# EAGLE design USB-CB (EAGLE 6.1)
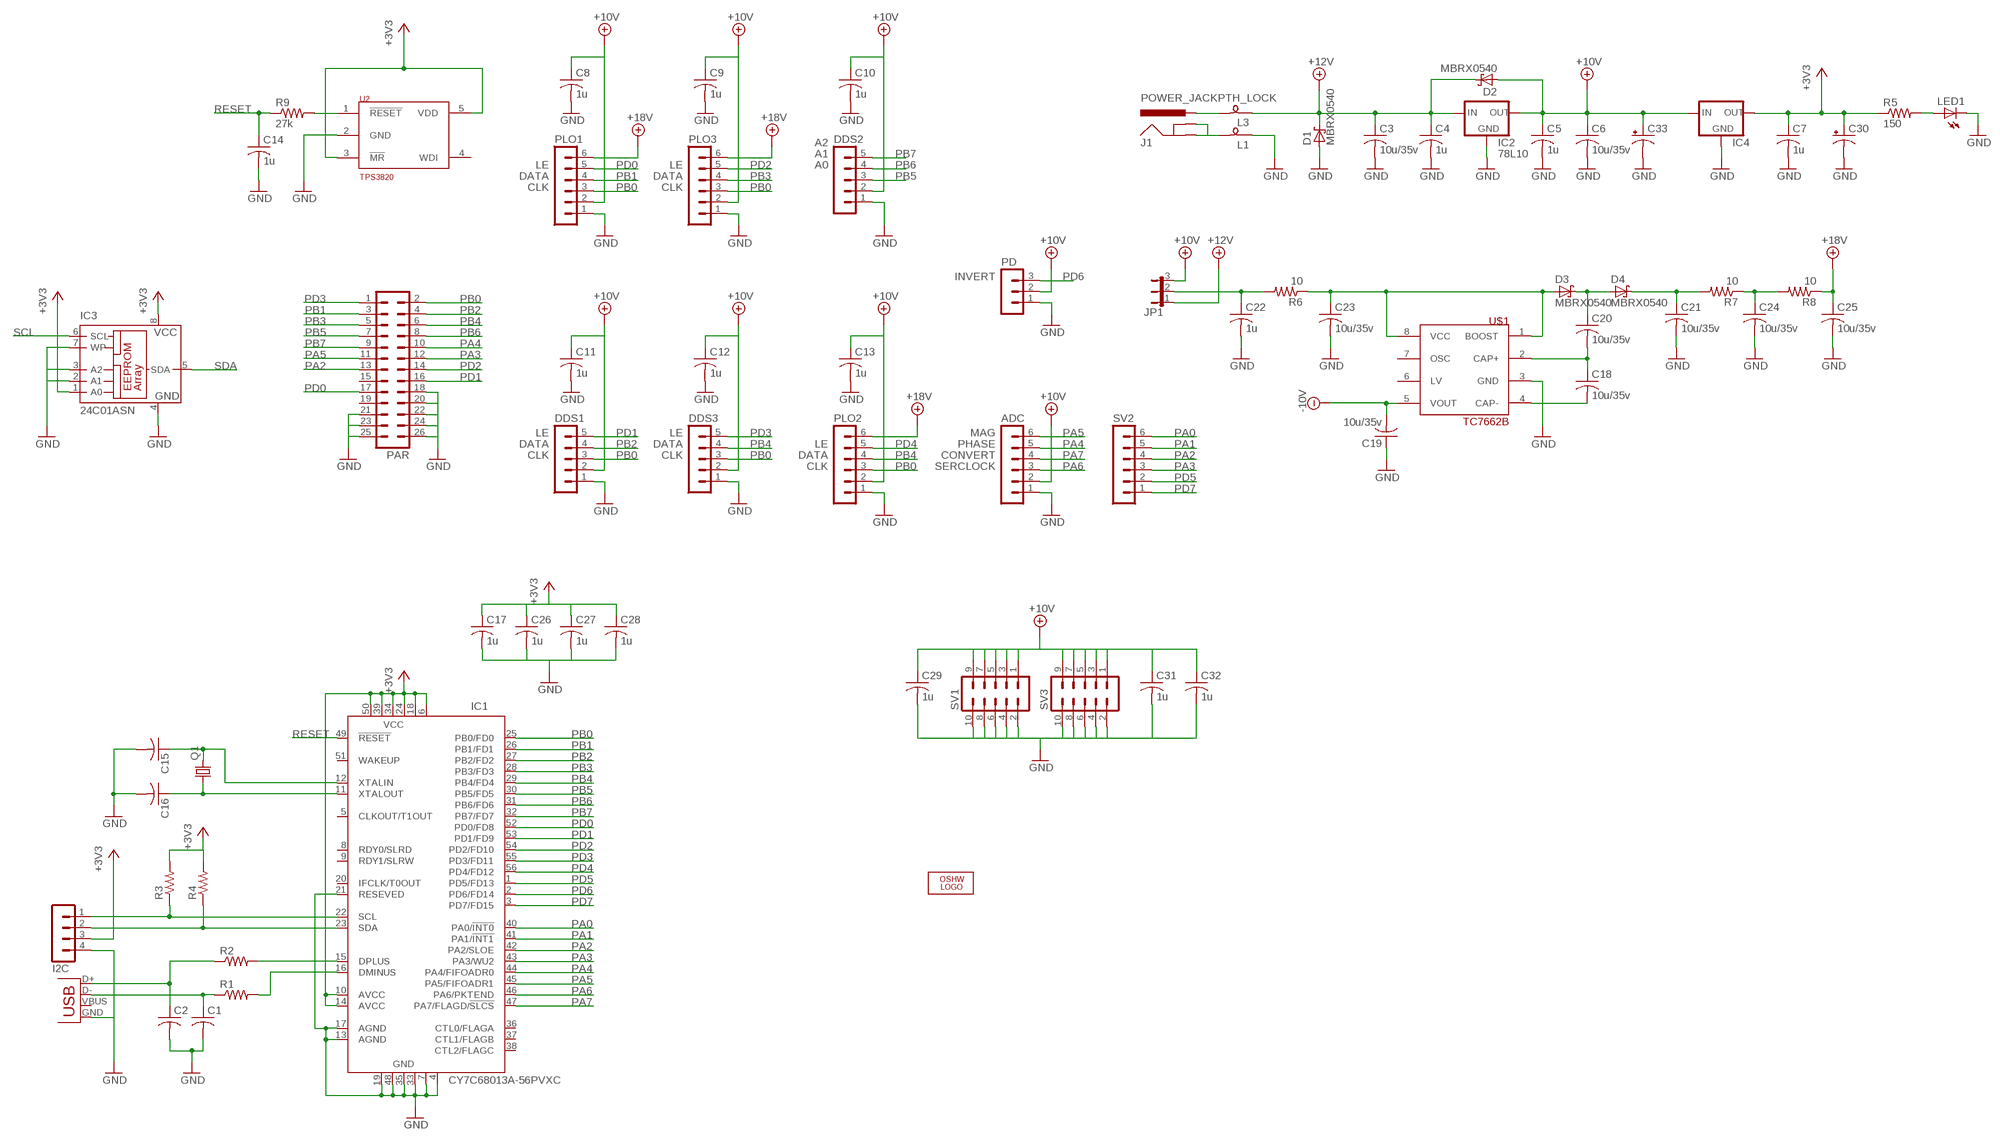
[diagram p0: schematic, sheet 1]

## Parts
ADC  MA06-1  [MA06-1]
C1  C-USC0603  [C0603]
C2  C-USC0603  [C0603]
C3  10u/35v  C-USC1206  [C1206]
C4  1u  C-USC0603  [C0603]
C5  1u  C-USC0603  [C0603]
C6  10u/35v  C-USC1206  [C1206]
C7  1u  C-USC0603  [C0603]
C8  1u  C-USC0603  [C0603]
C9  1u  C-USC0603  [C0603]
C10  1u  C-USC0603  [C0603]
C11  1u  C-USC0603  [C0603]
C12  1u  C-USC0603  [C0603]
C13  1u  C-USC0603  [C0603]
C14  1u  C-USC0603  [C0603]
C15  C-USC0603  [C0603]
C16  C-USC0603  [C0603]
C17  1u  C-USC0603  [C0603]
C18  10u/35v  C-USC1206  [C1206]
C19  10u/35v  C-USC1206  [C1206]
C20  10u/35v  C-USC1206  [C1206]
C21  10u/35v  C-USC1206  [C1206]
C22  1u  C-USC0603  [C0603]
C23  10u/35v  C-USC1206  [C1206]
C24  10u/35v  C-USC1206  [C1206]
C25  10u/35v  C-USC1206  [C1206]
C26  1u  C-USC0603  [C0603]
C27  1u  C-USC0603  [C0603]
C28  1u  C-USC0603  [C0603]
C29  1u  C-USC0603  [C0603]
C30  CPOL-USE2.5-6  [E2,5-6]
C31  1u  C-USC0603  [C0603]
C32  1u  C-USC0603  [C0603]
C33  CPOL-USE2.5-6  [E2,5-6]
D1  MBRX0540  [SOD323-R]
D2  MBRX0540  [SOD323-R]
D3  MBRX0540  [SOD323-R]
D4  MBRX0540  [SOD323-R]
DDS1  MA05-1  [MA05-1]
DDS2  MA05-1  [MA05-1]
DDS3  MA05-1  [MA05-1]
I2C  MA04-1  [MA04-1]
IC1  CY7C68013A-56PVXC  [SSOP56]
IC2  78L10  78XXS  [78XXS]
IC3  24C01ASN  [SO-08]
IC4  78LXXAC  [SOT89R]
J1  POWER_JACKPTH_LOCK  [POWER_JACK_PTH_LOCK]
JP1  JP2E  [JP2]
L1  SM-B5  [SM-B5]
L3  SM-B5  [SM-B5]
LED1  LED5MM  [LED5MM]
LOGO1  OSHW_LOGO_FILLX0200-NT  [OSHW_FILLX200_NOTEXT]
PAR  MA13-2  [MA13-2]
PD  MA03-1  [MA03-1]
PLO1  MA06-1  [MA06-1]
PLO2  MA06-1  [MA06-1]
PLO3  MA06-1  [MA06-1]
Q1  CRYSTALHC49S  [HC49/S]
R1  R-US_R0603  [R0603]
R2  R-US_R0603  [R0603]
R3  R-US_R0603  [R0603]
R4  R-US_R0603  [R0603]
R5  150  R-US_R0603  [R0603]
R6  10  R-US_R0603  [R0603]
R7  10  R-US_R0603  [R0603]
R8  10  R-US_R0603  [R0603]
R9  27k  R-US_R0603  [R0603]
SV1  MA05-2PIN  [MA05-2]
SV2  MA06-1  [MA06-1]
SV3  MA05-2PIN  [MA05-2]
U2  TPS3820  [SC74_INFINEON]
U$1  TC7662B  [SO-08]
X1  USBSMD  [USB-MINIB]

## Nets
+3V3: C7.1 C17.1 C26.1 C27.1 C28.1 C30.+ I2C.3 IC1.6(VCC) IC1.10(AVCC) IC1.14(AVCC) IC1.18(VCC) IC1.24(VCC) IC1.34(VCC) IC1.39(VCC) IC1.50(VCC) IC3.1(A0) IC3.8(VCC) IC4.3(OUT) R3.2 R4.2 R5.1 U2.3(!MR) U2.5(VDD)
+10V: ADC.2 C5.1 C6.1 C8.1 C9.1 C10.1 C11.1 C12.1 C13.1 C29.1 C31.1 C32.1 C33.+ D2.A DDS1.2 DDS2.2 DDS3.2 IC2.OUT IC4.1(IN) JP1.3 PD.2 PLO1.2 PLO2.2 PLO3.2 SV1.1 SV1.3 SV1.5 SV1.7 SV1.9 SV3.1 SV3.3 SV3.5 SV3.7 SV3.9
+12V: C3.1 C4.1 D1.C D2.C IC2.IN JP1.1 L3.1
+18V: C25.1 PLO1.6 PLO2.6 PLO3.6 R8.1
-10V: C19.2 U$1.5(VOUT)
GND: ADC.1 C1.2 C2.2 C3.2 C4.2 C5.2 C6.2 C7.2 C8.2 C9.2 C10.2 C11.2 C12.2 C13.2 C14.2 C15.2 C16.2 C17.2 C19.1 C21.2 C22.2 C23.2 C24.2 C25.2 C26.2 C27.2 C28.2 C29.2 C30.- C31.2 C32.2 C33.- D1.A DDS1.1 DDS2.1 DDS3.1 I2C.4 IC1.4(GND) IC1.7(GND) IC1.13(AGND) IC1.17(AGND) IC1.19(GND) IC1.21(RESEVED) IC1.33(GND) IC1.35(GND) IC1.48(GND) IC2.GND IC3.2(A1) IC3.3(A2) IC3.4(GND) IC3.7(WP) IC4.2(GND) L1.1 LED1.K(C) PAR.18 PAR.20 PAR.21 PAR.22 PAR.23 PAR.24 PAR.25 PAR.26 PD.1 PLO1.1 PLO2.1 PLO3.1 SV1.2 SV1.4 SV1.6 SV1.8 SV1.10 SV3.2 SV3.4 SV3.6 SV3.8 SV3.10 U2.2(GND) U$1.3(GND) X1.GND
N$2: J1.GNDBREAK
N$3: IC1.15(DPLUS) R2.2
N$4: IC1.16(DMINUS) R1.2
N$5: C1.1 R1.1 X1.D-
N$6: C2.1 R2.1 X1.D+
N$7: C22.1 JP1.2 R6.2
N$8: C21.1 D4.C R7.2
N$9: C23.1 D3.A R6.1 U$1.1(BOOST) U$1.8(VCC)
N$12: C18.2 U$1.4(CAP-)
N$13: C18.1 C20.2 U$1.2(CAP+)
N$14: C20.1 D3.C D4.A
N$15: C24.1 R7.1 R8.2
N$16: J1.GND L1.2
N$17: J1.PWR L3.2
N$18: R9.2 U2.1(!RESET)
N$21: C16.1 IC1.11(XTALOUT) Q1.1
N$22: C15.1 IC1.12(XTALIN) Q1.2
N$24: LED1.A R5.2
PA0: IC1.40(PA0/!INT0) SV2.6
PA1: IC1.41(PA1/!INT1) SV2.5
PA2: IC1.42(PA2/SLOE) PAR.13 SV2.4
PA3: IC1.43(PA3/WU2) PAR.12 SV2.3
PA4: ADC.5 IC1.44(PA4/FIFOADR0) PAR.10
PA5: ADC.6 IC1.45(PA5/FIFOADR1) PAR.11
PA6: ADC.3 IC1.46(PA6/PKTEND)
PA7: ADC.4 IC1.47(PA7/FLAGD/!SLCS)
PB0: DDS1.3 DDS3.3 IC1.25(PB0/FD0) PAR.2 PLO1.3 PLO2.3 PLO3.3
PB1: IC1.26(PB1/FD1) PAR.3 PLO1.4
PB2: DDS1.4 IC1.27(PB2/FD2) PAR.4
PB3: IC1.28(PB3/FD3) PAR.5 PLO3.4
PB4: DDS3.4 IC1.29(PB4/FD4) PAR.6 PLO2.4
PB5: DDS2.3 IC1.30(PB5/FD5) PAR.7
PB6: DDS2.4 IC1.31(PB6/FD6) PAR.8
PB7: DDS2.5 IC1.32(PB7/FD7) PAR.9
PD0: IC1.52(PD0/FD8) PAR.17 PLO1.5
PD1: DDS1.5 IC1.53(PD1/FD9) PAR.16
PD2: IC1.54(PD2/FD10) PAR.14 PLO3.5
PD3: DDS3.5 IC1.55(PD3/FD11) PAR.1
PD4: IC1.56(PD4/FD12) PLO2.5
PD5: IC1.1(PD5/FD13) SV2.2
PD6: IC1.2(PD6/FD14) PD.3
PD7: IC1.3(PD7/FD15) SV2.1
RESET: C14.1 IC1.49(!RESET) R9.1
SCL: I2C.1 IC1.22(SCL) IC3.6(SCL) R3.1
SDA: I2C.2 IC1.23(SDA) IC3.5(SDA) R4.1
Unconnected: IC1.5(CLKOUT/T1OUT) IC1.8(RDY0/SLRD) IC1.9(RDY1/SLRW) IC1.20(IFCLK/T0OUT) IC1.36(CTL0/FLAGA) IC1.37(CTL1/FLAGB) IC1.38(CTL2/FLAGC) IC1.51(WAKEUP) PAR.15 PAR.19 U2.4(WDI) U$1.6(LV) U$1.7(OSC) X1.VBUS

## Notes on the sheet
- A2
- A1
- LE | LE | A0
- DATA | DATA
- CLK | CLK
- INVERT
- LE | LE | MAG
- DATA | DATA | LE | PHASE
- CLK | CLK | DATA | CONVERT
- CLK | SERCLOCK

## Library data of the parts
ADC PLO1-PLO3 SV2 = con-lstb:MA06-1: PIN HEADER
C1-C29 C31 C32 = rcl:C-US: CAPACITOR, American symbol
C30 C33 = rcl:CPOL-US: POLARIZED CAPACITOR, American symbol
D1-D4 = Misc:MBRX0540
DDS1-DDS3 = con-lstb:MA05-1: PIN HEADER
I2C = con-lstb:MA04-1: PIN HEADER
IC1 = cypress:CY7C6801*A-56: EZ-USB FX2LP (TM) USB Microcontroller Source: http://www.cypress.com .. cy7c68013a_5.pdf; MF: CYPRESS SEMICONDUCTOR CORPORAT; MPN: CY7C68013A-56PVXC; OC_FARNELL: 1269134; OC_NEWARK: 19M7114
IC2 = v-reg:78XXS: VOLTAGE REGULATOR
IC3 = microchip:24C*: Serial EEPROM 1 K/2 K/4 K
IC4 = Misc:78LXX: VOLTAGE REGULATOR
J1 = SparkFun:POWER_JACK: Power Jack This is the standard 5.5mm barrel jack for power. The PTH is the most common, proven, reliable, footprint. All others are experimental. The Slot footprint only works if the mill layer is transmitted to the PCB fab house so be warned. Spark Fun Electronics SKU : PRT-00119. Mating wall wart : TOL-00298 (and others)
JP1 = jumper:JP2E: JUMPER
L1 L3 = inductor-neosid:SM-B: INDUCTOR SMD Bead inductor; OC_FARNELL: unknown; OC_NEWARK: unknown
LED1 = led:LED: LED OSRAM: - CHIPLED LG R971, LG N971, LY N971, LG Q971, LY Q971, LO R971, LY R971 LH N974, LH R974 LS Q976, LO Q976, LY Q976 LO Q996 - Hyper CHIPLED LW Q18S LB Q993, LB Q99A, LB R99A - SideLED LS A670, LO A670, LY A670, LG A670, LP A670 LB A673, LV A673, LT A673, LW A673 LH A674 LY A675 LS A676, LA A676, LO A676, LY A676, LW A676 LS A679, LY A679, LG A679 - Hyper Micro SIDELED® LS Y876, LA Y876, LO Y876, LY Y876 LT Y87S - SmartLED LW L88C, LW L88S LB L89C, LB L89S, LG L890 LS L89K, LO L89K, LY L89K LS L896, LA L896, LO L896, LY L896 - TOPLED LS T670, LO T670, LY T670, LG T670, LP T670 LSG T670, LSP T670, LSY T670, LOP T670, LYG T670 LG T671, LOG T671, LSG T671 LB T673, LV T673, LT T673, LW T673 LH T674 LS T676, LA T676, LO T676, LY T676, LB T676, LH T676, LSB T676, LW T676 LB T67C, LV T67C, LT T67C, LS T67K, LO T67K, LY T67K, LW E67C LS E67B, LA E67B, LO E67B, LY E67B, LB E67C, LV E67C, LT E67C LW T67C LS T679, LY T679, LG T679 LS T770, LO T770, LY T770, LG T770, LP T770 LB T773, LV T773, LT T773, LW T773 LH T774 LS E675, LA E675, LY E675, LS T675 LS T776, LA T776, LO T776, LY T776, LB T776 LHGB T686 LT T68C, LB T68C - Hyper Mini TOPLED® LB M676 - Mini TOPLED Santana® LG M470 LS M47K, LO M47K, LY M47K Source: http://www.osram.convergy.de LUXEON: - LUMILED® LXK2-PW12-R00, LXK2-PW12-S00, LXK2-PW14-U00, LXK2-PW14-V00 LXK2-PM12-R00, LXK2-PM12-S00, LXK2-PM14-U00 LXK2-PE12-Q00, LXK2-PE12-R00, LXK2-PE12-S00, LXK2-PE14-T00, LXK2-PE14-U00 LXK2-PB12-K00, LXK2-PB12-L00, LXK2-PB12-M00, LXK2-PB14-N00, LXK2-PB14-P00, LXK2-PB14-Q00 LXK2-PR12-L00, LXK2-PR12-M00, LXK2-PR14-Q00, LXK2-PR14-R00 LXK2-PD12-Q00, LXK2-PD12-R00, LXK2-PD12-S00 LXK2-PH12-R00, LXK2-PH12-S00 LXK2-PL12-P00, LXK2-PL12-Q00, LXK2-PL12-R00 Source: www.luxeon.com KINGBRIGHT: KA-3528ASYC Source: www.kingbright.com
LOGO1 = OSHW:OSHW_LOGO_FILL
PAR = con-lstb:MA13-2: PIN HEADER
PD = con-lstb:MA03-1: PIN HEADER
Q1 = crystal:CRYSTAL: CRYSTAL; OC_FARNELL: 1667008; OC_NEWARK: unknown
R1-R9 = rcl:R-US_: RESISTOR, American symbol
SV1 SV3 = con-lstb:MA05-2: PIN HEADER
U2 = TI:TPS3820
U$1 = microchip:TC7662B
X1 = SparkFun:USB: USB Connectors USB-B-PTH is fully proven SKU : PRT-00139 USB-miniB is fully proven SKU : PRT-00587 USB-A-PCB is untested. USB-A-H is throughly reviewed, but untested. Spark Fun Electronics SKU : PRT-00437 USB-B-SMT is throughly reviewed, but untested. Needs silkscreen touching up. USB-A-S has not been used/tested USB-MB-H has not been used/tested

## Board
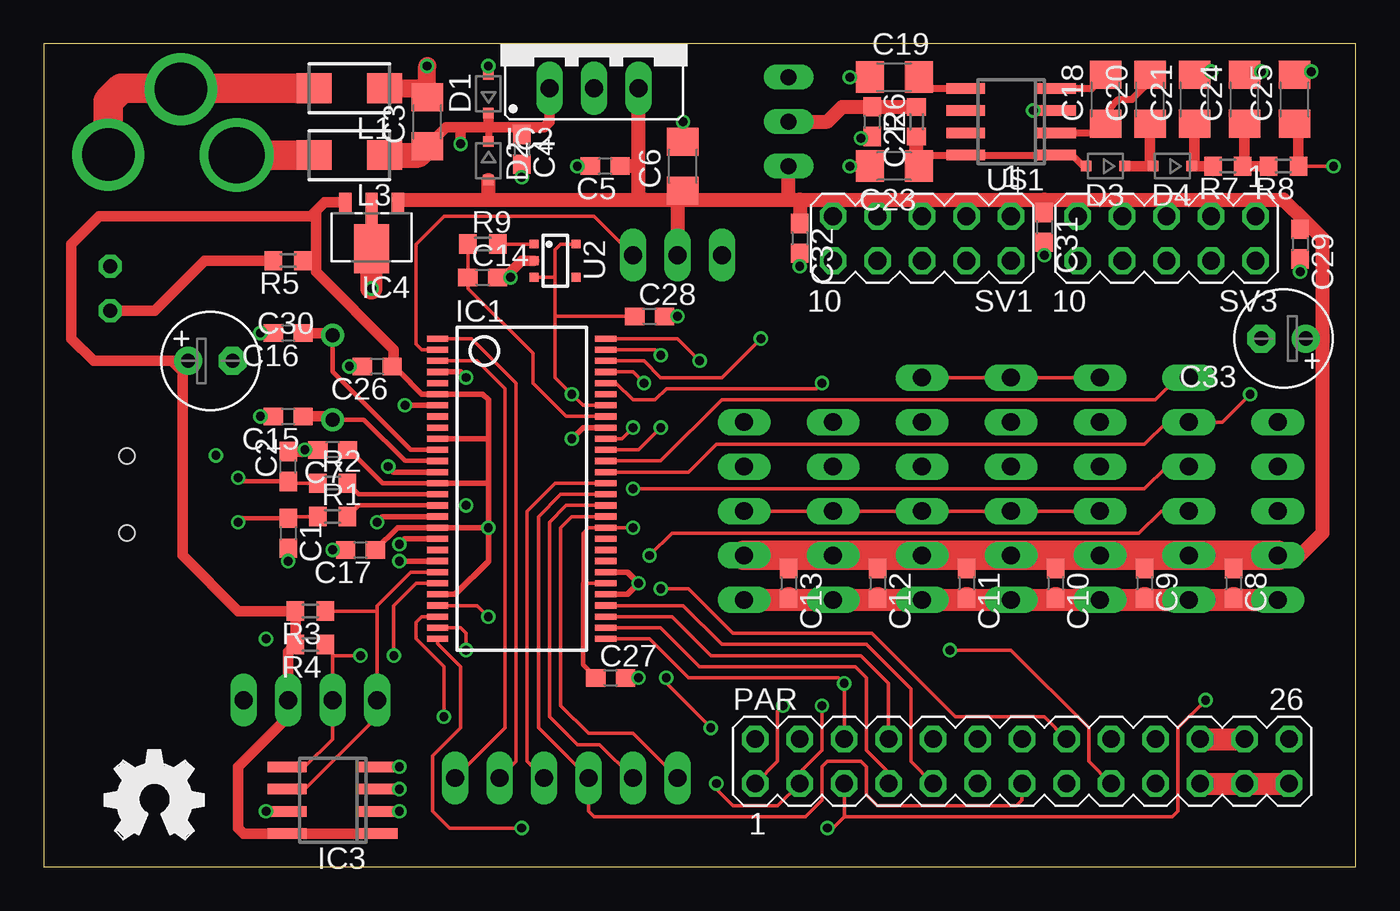
[diagram p1: board, top side]
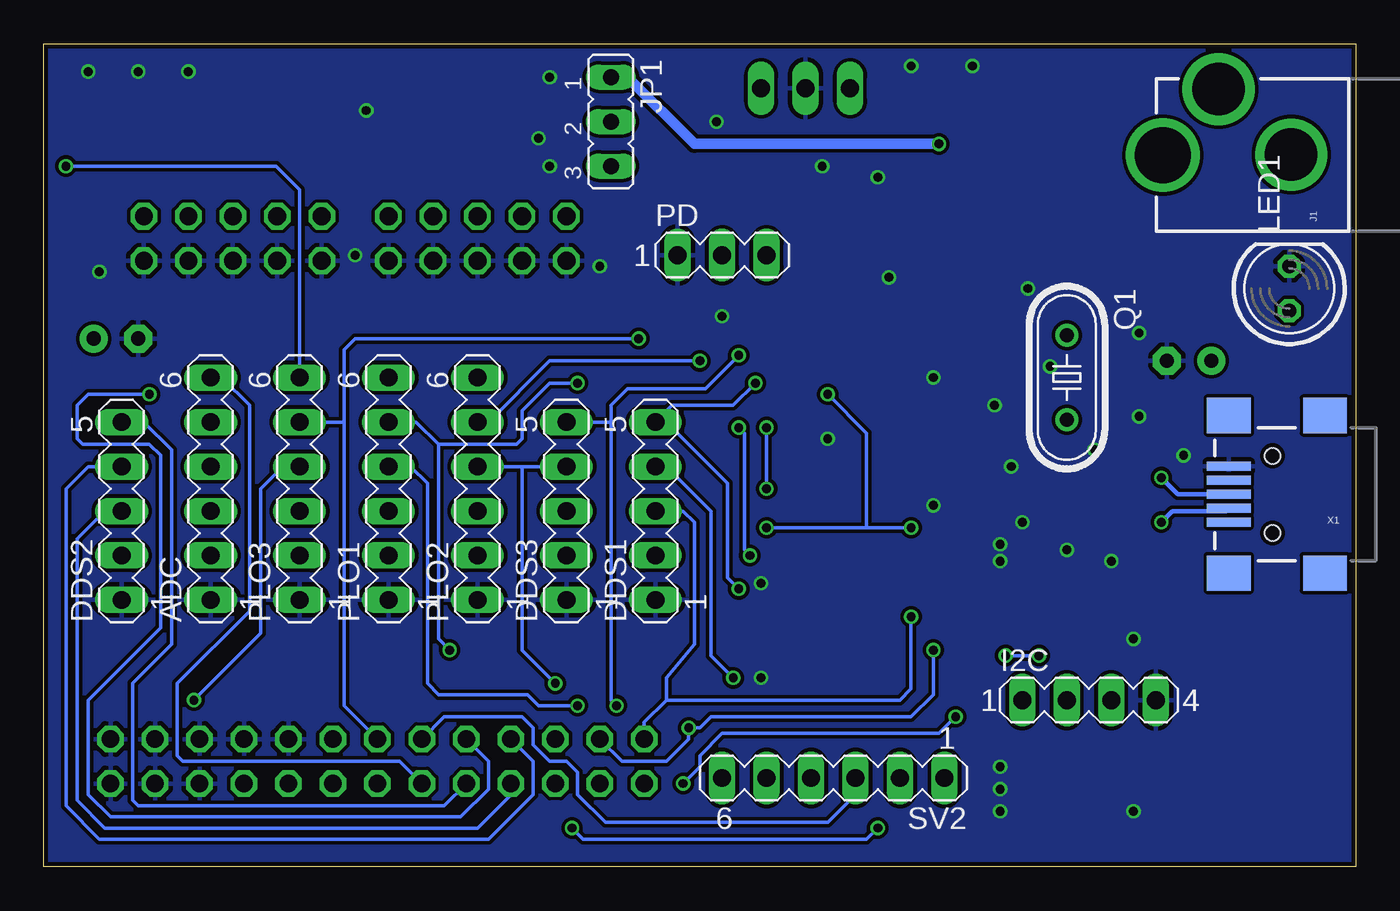
[diagram p2: board, bottom side, seen from below]

Size 74.92 x 46.98 mm. Coordinates in mm from the lower left corner, seen from the top.
Outline: 74.92,46.98 0,46.98 0,0 74.92,0 74.92,46.98
Copper layers (1*16): Top 0.035mm / dielectric 1.5mm / Bottom 0.035mm
Design rules: minimum track width 6mil, minimum drill 12mil, track to track 6mil, track to pad 6mil, pad to pad 6mil, via to via 6mil, smd to smd 0mil, copper to edge 10mil, drill to drill 10mil, minimum pad ring 10mil, minimum via ring 6mil, stop-mask expansion 2mil, vias tented up to drill 100mil, thermal gap 10mil

### Footprints (pad centres in the part's own frame; a part is rotated, then mirrored left to right if it is on the bottom)
MA06-1 = drill 1.016 long: 1 -6.35,0; 2 -3.81,0; 3 -1.27,0; 4 1.27,0; 5 3.81,0; 6 6.35,0
C0603 = smd 1.1 x 1: 1 -0.85,0; 2 0.85,0
C1206 = smd 1.6 x 1.8: 1 -1.4,0; 2 1.4,0
E2,5-6 = drill 0.813 pad 1.6: + -1.27,0 | drill 0.813 pad 1.6 octagon: - 1.27,0
SOD323-R = smd 0.6 x 0.6: A 1.1,0; C -1.1,0
MA05-1 = drill 1.016 long: 1 -5.08,0; 2 -2.54,0; 3 0,0; 4 2.54,0; 5 5.08,0
MA04-1 = drill 1.016 long: 1 -3.81,0; 2 -1.27,0; 3 1.27,0; 4 3.81,0
SSOP56 = smd 0.35 x 1.2: 1 -8.572,-4.8; 2 -7.938,-4.8; 3 -7.303,-4.8; 4 -6.668,-4.8; 5 -6.032,-4.8; 6 -5.397,-4.8; 7 -4.763,-4.8; 8 -4.128,-4.8; 9 -3.493,-4.8; 10 -2.857,-4.8; 11 -2.223,-4.8; 12 -1.587,-4.8; 13 -0.953,-4.8; 14 -0.318,-4.8; 15 0.318,-4.8; 16 0.953,-4.8; 17 1.587,-4.8; 18 2.223,-4.8; 19 2.857,-4.8; 20 3.493,-4.8; 21 4.128,-4.8; 22 4.763,-4.8; 23 5.397,-4.8; 24 6.032,-4.8; 25 6.668,-4.8; 26 7.303,-4.8; 27 7.938,-4.8; 28 8.572,-4.8; 29 8.572,4.8; 30 7.938,4.8; 31 7.303,4.8; 32 6.668,4.8; 33 6.032,4.8; 34 5.397,4.8; 35 4.763,4.8; 36 4.128,4.8; 37 3.493,4.8; 38 2.857,4.8; 39 2.223,4.8; 40 1.587,4.8; 41 0.953,4.8; 42 0.318,4.8; 43 -0.318,4.8; 44 -0.953,4.8; 45 -1.587,4.8; 46 -2.223,4.8; 47 -2.857,4.8; 48 -3.493,4.8; 49 -4.128,4.8; 50 -4.763,4.8; 51 -5.397,4.8; 52 -6.032,4.8; 53 -6.668,4.8; 54 -7.303,4.8; 55 -7.938,4.8; 56 -8.572,4.8
78XXS = drill 1.016 long: GND 0,-2.54; IN -2.54,-2.54; OUT 2.54,-2.54
SO-08 = smd 0.6 x 2.2: 1 -1.905,-2.6; 2 -0.635,-2.6; 3 0.635,-2.6; 4 1.905,-2.6; 5 1.905,2.6; 6 0.635,2.6; 7 -0.635,2.6; 8 -1.905,2.6
SOT89R = smd 0.7 x 1.1: 1 -1.5,-1.75; 3 1.5,-1.75 | smd 0.7 x 1.8: 2 0,-1.4 | smd 2 x 2.8: 4 0,0.9
POWER_JACK_PTH_LOCK = drill 2.997 pad 4.115: GND 0.025,6.557; GNDBREAK 3.762,10.7 | drill 3.2 pad 4.115: PWR 0,13.878
JP2 = drill 0.914 long: 1 -2.54,0; 2 0,0; 3 2.54,0
SM-B5 = smd 2 x 1.7: 1 -2,0; 2 2,0
LED5MM = drill 0.813 octagon: A -1.27,0; K 1.27,0
MA13-2 = drill 1.016 octagon: 1 -15.24,-1.27; 2 -15.24,1.27; 3 -12.7,-1.27; 4 -12.7,1.27; 5 -10.16,-1.27; 6 -10.16,1.27; 7 -7.62,-1.27; 8 -7.62,1.27; 9 -5.08,-1.27; 10 -5.08,1.27; 11 -2.54,-1.27; 12 -2.54,1.27; 13 0,-1.27; 14 0,1.27; 15 2.54,-1.27; 16 2.54,1.27; 17 5.08,-1.27; 18 5.08,1.27; 19 7.62,-1.27; 20 7.62,1.27; 21 10.16,-1.27; 22 10.16,1.27; 23 12.7,-1.27; 24 12.7,1.27; 25 15.24,-1.27; 26 15.24,1.27
MA03-1 = drill 1.016 long: 1 -2.54,0; 2 0,0; 3 2.54,0
HC49/S = drill 0.813: 1 -2.413,0; 2 2.413,0
R0603 = smd 1 x 1.1: 1 -0.85,0; 2 0.85,0
MA05-2 = drill 1.016 octagon: 1 -5.08,-1.27; 2 -5.08,1.27; 3 -2.54,-1.27; 4 -2.54,1.27; 5 0,-1.27; 6 0,1.27; 7 2.54,-1.27; 8 2.54,1.27; 9 5.08,-1.27; 10 5.08,1.27
SC74_INFINEON = smd 0.5 x 0.5: 1 -0.95,-1.2; 2 0,-1.2; 3 0.95,-1.2; 4 0.95,1.2; 5 -0.95,1.2
USB-MINIB = smd 2.5 x 0.5: D+ 2.5,0; D- 2.5,0.8; GND 2.5,-1.6; ID 2.5,-0.8; VBUS 2.5,1.6 | smd 2.5 x 2: GND@1 -3,-4.5; GND@2 -3,4.5; GND@3 2.5,4.5; GND@4 2.5,-4.5 | hole 0.9: 0,2.2; 0,-2.2

### Placement (x,y rotation side)
ADC  65.39,21.58 90 bottom
C1  13.96,19.04 270 top
C2  13.96,22.85 90 top
C3  21.89,42.54 90 top
C4  27.29,40.95 270 top
C5  32.05,40 180 top
C6  36.5,40 90 top
C7  16.5,23.8 180 top
C8  67.93,16.18 270 top
C9  62.85,16.18 270 top
C10  57.77,16.18 270 top
C11  52.69,16.18 270 top
C12  47.61,16.18 270 top
C13  42.53,16.18 270 top
C14  25.07,33.65 0 top
C15  13.96,25.71 180 top
C16  13.96,30.47 180 top
C17  18.09,18.09 180 top
C18  60.63,43.8 90 top
C19  48.56,45.08 0 top
C20  63.17,43.8 90 top
C21  65.71,43.8 90 top
C22  47.29,42.54 270 top
C23  48.56,40 180 top
C24  68.57,43.8 90 top
C25  71.42,43.8 90 top
C26  19.04,28.56 180 top
C27  32.37,10.79 0 top
C28  34.59,31.42 0 top
C29  71.74,35.55 270 top
C30  9.51,28.88 0 top
C31  57.14,36.5 270 top
C32  43.17,35.87 270 top
C33  70.79,30.15 180 top
D1  25.39,44.12 90 top
D2  25.39,40.31 270 top
D3  60.63,40 180 top
D4  64.44,40 180 top
DDS1  39.99,20.31 90 bottom
DDS2  70.47,20.31 90 bottom
DDS3  45.07,20.31 90 bottom
I2C  15.23,9.52 0 bottom
IC1  27.29,21.58 270 top
IC2  31.42,46.98 0 top
IC3  16.5,3.8 90 top
IC4  18.72,36.19 180 top
J1  -2.87,40.63 90 bottom
JP1  42.53,42.54 270 bottom
L1  17.45,44.44 180 top
L3  17.45,40.63 180 top
LED1  3.8,33.01 90 bottom
LOGO1  3.48,1.58 0 top
PAR  55.87,6.02 0 top
PD  36.18,34.91 0 bottom
PLO1  55.23,21.58 90 bottom
PLO2  50.15,21.58 90 bottom
PLO3  60.31,21.58 90 bottom
Q1  16.5,27.93 270 bottom
R1  16.5,19.99 0 top
R2  16.5,21.9 0 top
R3  15.23,14.6 180 top
R4  15.23,12.69 180 top
R5  13.96,34.6 180 top
R6  49.83,42.54 90 top
R7  67.61,40 180 top
R8  70.79,40 180 top
R9  25.07,35.55 0 top
SV1  50.15,35.87 180 top
SV2  29.83,5.07 180 bottom
SV3  64.12,35.87 180 top
U2  29.2,34.6 270 top
U$1  55.23,42.54 90 top
X1  4.75,21.26 180 bottom

### Tracks (layer width: path | path; a pad name or v marks a point on that pad's centre or on a via)
+3V3  (via drill 0.51)
  Top 0.203: IC1.34 30.78,16.18 30.78,19.04 31.1,19.36 IC1.39 v33.64,19.36 | IC1.50 30.78,26.34 v30.15,26.98 29.2,27.93 29.2,31.42 | U2.5 29.51,35.55 29.2,35.23 29.2,33.65 | 29.2,31.42 29.2,33.65 | 29.2,31.42 C28.1 | U2.3 29.19,33.65 29.2,33.65
  Top 0.254: 20.31,28.25 19.99,28.88 C26.1 | IC1.14 19.35,21.9 17.45,23.8 C7.1 | 30.78,16.18 30.78,11.52 C27.1
  Top 0.305: IC1.24 23.48,15.55 25.39,17.45 v25.39,19.36 | 25.39,21.9 v25.39,19.36 | 25.39,24.44 25.39,21.9 | 25.39,24.44 25.39,26.66 25.07,26.98 IC1.6 21.58,26.98 20.31,28.25 | v25.39,19.36 IC1.18 20.21,19.36 C17.1 | 25.39,21.9 IC1.14 | 25.39,24.44 IC1.10
  Top 0.61: IC3.1 IC3.8 11.42,1.9 11.1,2.21 11.1,5.71 13.96,8.56 I2C.3 13.96,12.27 R4.2 R3.2 11.1,14.6 7.93,17.77 7.93,28.25 7.29,28.88 | IC4.3 16.03,37.94 15.54,37.46 | 15.54,34.6 15.54,33.96 19.99,29.52 19.99,28.88 | 15.54,37.46 15.54,34.6 | 15.54,34.6 R5.1 | 7.29,28.88 2.84,28.88 1.57,30.15 1.57,35.55 3.16,37.14 15.23,37.14 15.54,37.46 | 7.29,28.88 C30.+
  Bottom 0.203: 27.93,19.36 v33.64,19.36 | v30.15,26.98 27.93,24.75 27.93,19.36 | v25.39,19.36 27.93,19.36
+10V
  Top 0.406: 34.28,38.09 33.96,38.41
  Top 0.61: IC4.1 20.37,38.09 | 73.01,30.15 C33.+
  Top 0.813: 72.06,36.82 70.79,38.09 69.2,38.09 | 72.06,36.82 73.01,35.87 73.01,30.15 73.01,19.04 71.74,17.77 DDS2.2 | 25.39,38.09 34.28,38.09 36.18,38.09 | 36.18,38.09 36.5,38.09 | 36.5,38.09 42.53,38.09 | 42.53,38.09 43.17,38.09 | 43.17,38.09 45.07,38.09 | 45.07,38.09 47.61,38.09 | 47.61,38.09 50.15,38.09 | 50.15,38.09 52.69,38.09 | 52.69,38.09 55.23,38.09 | 55.23,38.09 57.14,38.09 | 57.14,38.09 59.04,38.09 | 59.04,38.09 61.58,38.09 | 61.58,38.09 64.12,38.09 | 64.12,38.09 66.66,38.09 | 66.66,38.09 69.2,38.09 | 36.18,38.09 PD.2 | 36.5,38.09 C6.1 | 42.53,38.09 JP1.3 | 25.39,38.09 D2.A | 33.96,38.41 33.96,40 | 33.96,40 IC2.OUT | 33.96,40 C5.1 | 20.37,38.09 25.39,38.09 | 43.17,38.09 C32.1 | 45.07,38.09 SV1.9 | 47.61,38.09 SV1.7 | 50.15,38.09 SV1.5 | 52.69,38.09 SV1.3 | 55.23,38.09 SV1.1 | 59.04,38.09 SV3.9 | 61.58,38.09 SV3.7 | 64.12,38.09 SV3.5 | 66.66,38.09 SV3.3 | 69.2,38.09 SV3.1 | C29.1 72.06,36.72 72.06,36.82 | 57.14,38.09 C31.1
  Top 1.016: 47.61,17.77 C12.1 | 52.69,17.77 C11.1 | 57.77,17.77 C10.1 | 62.85,17.77 C9.1 | 67.93,17.77 C8.1 | 42.53,17.77 C13.1
  Top 1.676: DDS1.2 42.53,17.77 DDS3.2 47.61,17.77 PLO2.2 52.69,17.77 PLO1.2 57.77,17.77 PLO3.2 62.85,17.77 ADC.2 67.93,17.77 DDS2.2
+12V  (via drill 0.51)
  Top 0.406: 25.39,42.22 D2.C | 27.29,42.22 C4.1
  Top 0.61: IC2.IN 28.88,42.54 28.56,42.22 27.29,42.22 25.39,42.22 | 23.8,42.22 25.39,42.22 | 23.8,42.22 22.98,42.22 C3.1 | 25.39,42.22 D1.C | 23.8,42.22 v23.8,41.27
  Top 1.422: L3.1 21.39,40.63 C3.1
  Bottom 0.61: JP1.1 41.58,45.08 37.77,41.27 v23.8,41.27
+18V  (via drill 0.51)
  Top 0.203: PLO3.6 PLO1.6 PLO2.6 | v73.65,40 R8.1
  Top 0.406: 71.64,42.19 C25.1
  Top 0.61: R8.1 71.64,42.19
  Bottom 0.203: PLO3.6 60.31,38.65 61.66,40 v73.65,40
-10V
  Top 0.406: U$1.5 50.05,44.44 C19.2
GND  (via drill 0.51)
  Top 0.254: C27.2 v33.96,10.79
  Top 0.305: IC1.21 v20.31,17.45 | IC1.19 20.62,18.72 v20.31,18.4 | IC1.17 19.35,19.99 v19.04,19.67 | IC1.13 19.99,22.53 v19.67,22.85 | IC1.7 v20.62,26.34 | IC1.4 23.8,28.25 v24.12,27.93 | v17.45,28.56 C26.2 | IC1.48 30.78,25.07 v30.15,24.44 | IC1.33 33.32,15.55 v33.96,16.18 33.32,16.82 IC1.35 | IC3.4 v20.31,5.71 | IC3.3 v20.31,4.44 | IC3.2 v20.31,3.17 | IC3.7 v12.69,3.17
  Top 0.61: D1.A v25.39,45.71 | C4.2 v27.29,39.36 | C5.2 v30.47,40 | C14.2 v26.66,33.65 26.66,33.96 27.29,34.6 U2.2 | C28.2 v36.18,31.42 | C19.1 v46.03,45.08 | C23.2 v46.03,40 | C22.2 46.76,41.69 v46.66,41.58 | U$1.3 v56.5,43.17 | C21.2 66.47,45.21 v66.66,45.39 | C24.2 69.33,45.21 v69.52,45.39 | C25.2 72.19,45.21 v72.38,45.39 | v57.14,34.91 C31.2 | C29.2 v71.74,33.96 | C32.2 v43.17,34.28 | C6.2 v36.5,42.54 | C7.2 v14.91,23.8 14.81,23.7 C2.2 | v13.96,17.45 C1.2 | C17.2 v16.5,18.09 | 18.72,34.91 IC4.2 | v12.37,30.47 C16.2 | v12.37,25.71 C15.2
  Top 1.016: L1.1 21.89,44.44 | 21.89,44.44 C3.2 | 21.89,44.44 v21.89,45.71
  Top 1.27: v18.72,33.01 18.72,34.91 | DDS1.1 42.53,15.23 | 42.53,15.23 47.61,15.23 | 47.61,15.23 52.69,15.23 | 52.69,15.23 57.77,15.23 | 57.77,15.23 62.85,15.23 | 62.85,15.23 67.93,15.23 | 67.93,15.23 DDS2.1 | 67.93,15.23 C8.2 | 62.85,15.23 C9.2 | 57.77,15.23 C10.2 | 42.53,15.23 C13.2 | 47.61,15.23 C12.2 | 52.69,15.23 C11.2 | PAR.25 PAR.23 PAR.21 | PAR.22 PAR.24
  other vias: 24.12,20.63 12.69,13.01 9.83,23.48
  pour Bottom (isolate 0.203): 74.92,-0.01 -0.33,-0.01 -0.33,46.98 74.92,46.98
N$3
  Top 0.254: IC1.15 17.98,21.26 R2.2
N$4
  Top 0.254: IC1.16 17.98,20.63 R1.2
N$5  (via drill 0.51)
  Top 0.203: R1.1 14.06,19.99 C1.1
  Top 0.254: C1.1 11.32,19.89 v11.1,19.67
  Bottom 0.254: v11.1,19.67 10.46,20.31 7.4,20.31 X1.D-
N$6  (via drill 0.51)
  Top 0.203: R2.1 14.06,21.9 C2.1
  Top 0.254: C2.1 11.32,22 v11.1,22.21
  Bottom 0.254: v11.1,22.21 10.15,21.26 X1.D+
N$7
  Top 0.813: JP1.2 44.75,42.54 45.6,43.39 C22.1 R6.2
N$8
  Top 0.406: D4.C 65.71,40.16
  Top 0.61: D4.C R7.2 | 65.71,40.16 C21.1
N$9
  Top 0.406: 49.83,40.12 C23.1 50.15,40.63 52.69,40.63 | 52.69,40.63 57.77,40.63 | U$1.8 52.63,40.69 52.69,40.63 | U$1.1 57.83,40.69 57.77,40.63 | 57.77,40.63 58.72,40.63 59.36,40 D3.A
  Top 0.813: 49.83,40.12 R6.1
N$12
  Top 0.406: U$1.4 59.86,44.44 C18.2
N$13
  Top 0.406: U$1.2 60.76,41.9 C18.1 60.82,42.41 60.82,43.26 61.37,43.8 62.14,43.8 62.85,44.52 62.85,45.08 62.98,45.21 C20.2
N$14
  Top 0.406: D4.A 63.17,40.16
  Top 0.61: D4.A D3.C | 63.17,40.16 C20.1
N$15
  Top 0.406: R7.1 68.57,40.1
  Top 0.61: R7.1 R8.2 | 68.57,40.1 C24.1
N$16
  Top 1.676: J1.GND 3.69,43.7 4.43,44.44 L1.2
N$17
  Top 1.676: J1.PWR L3.2
N$18
  Top 0.203: U2.1 R9.2
N$21
  Top 0.254: IC1.11 20.94,23.8 16.5,28.25 Q1.1
  Top 0.61: C16.1 16.37,30.47 Q1.1
N$22
  Top 0.254: IC1.12 20.62,23.17 18.28,25.52 Q1.2
  Top 0.61: C15.1 16.31,25.71 Q1.2
N$24
  Top 0.61: LED1.A 6.34,31.74 9.19,34.6 R5.2
PA0
  Top 0.203: IC1.40 30.15,19.99 29.51,19.36 29.51,9.2 31.1,7.61 33.64,7.61 SV2.6
PA1
  Top 0.203: IC1.41 29.83,20.63 28.88,19.67 28.88,8.56 30.47,6.98 31.74,6.98 SV2.5
PA2
  Top 0.203: IC1.42 29.51,21.26 28.25,19.99 28.25,7.93 SV2.4 31.1,3.17 31.42,2.85 43.49,2.85 44.44,3.8 44.44,5.71 44.75,6.02 46.66,6.02 46.98,5.71 46.98,4.12 47.61,3.48 55.55,3.48 55.87,3.8 PAR.13
PA3
  Top 0.203: IC1.43 29.2,21.9 27.61,20.31 27.61,6.02 SV2.3
  Bottom 0.203: PAR.12 52.06,8.56 47.61,8.56 46.98,7.93 46.98,6.98 46.03,6.02 45.07,6.02 44.44,5.39 44.44,4.12 42.85,2.53 30.15,2.53 28.56,4.12 SV2.3
PA4  (via drill 0.51)
  Top 0.203: v68.88,26.98 67.3,25.39 ADC.5 64.12,25.39 62.85,24.12 38.4,24.12 36.82,22.53 IC1.44
  Bottom 0.203: PAR.10 49.52,6.02 49.52,4.44 51.1,2.85 71.11,2.85 72.38,4.12 72.38,9.52 68.25,13.64 68.25,23.48 68.88,24.12 72.69,24.12 73.01,24.44 73.01,26.34 72.38,26.98 v68.88,26.98
PA5
  Top 0.203: IC1.45 35.23,23.17 38.72,26.66 63.49,26.66 64.76,27.93 ADC.6
  Bottom 0.203: ADC.6 64.76,27.93 63.17,26.34 63.17,14.6 67.3,10.47 67.3,6.34 66.98,6.02 54.6,6.02 PAR.11
PA6  (via drill 0.51)
  Top 0.203: ADC.3 63.81,20.31 62.53,19.04 35.86,19.04 v34.6,17.77 | IC1.46 33.96,23.8 v35.23,25.07
  Bottom 0.203: v34.6,17.77 34.91,18.09 34.91,24.75 v35.23,25.07
PA7  (via drill 0.51)
  Top 0.203: ADC.4 64.12,22.85 62.85,21.58 v33.64,21.58 | IC1.47 33.01,24.44 v33.64,25.07
  Bottom 0.203: v33.64,25.07 v33.64,21.58
PB0  (via drill 0.51)
  Top 0.203: IC1.25 24.75,14.91 v25.39,14.28 | DDS1.3 DDS3.3 PLO2.3 PLO1.3 PLO3.3
  Bottom 0.203: DDS1.3 38.4,20.31 37.77,19.67 37.77,12.69 39.36,10.79 39.36,9.52 | PAR.2 40.63,8.25 39.36,9.52 | v25.39,14.28 25.39,10.15 26.02,9.52 39.36,9.52
PB1  (via drill 0.51)
  Top 0.203: v44.44,9.2 44.44,6.66 43.17,5.39 PAR.3 41.9,3.48 39.36,3.48 38.4,4.44 v38.4,4.75 | IC1.26 21.58,14.28 21.26,13.96 21.26,13.01 22.85,11.42 v22.85,8.56
  Bottom 0.203: PLO1.4 53.96,22.85 53.01,21.9 53.01,10.47 52.38,9.83 47.29,9.83 46.66,9.2 v44.44,9.2 | v22.85,8.56 23.8,7.61 36.18,7.61 37.45,6.34 37.45,5.71 v38.4,4.75
PB2  (via drill 0.51)
  Top 0.203: IC1.27 23.8,13.64 24.12,13.33 v24.12,12.37 | v38.09,7.93 35.55,10.47 v35.55,10.79
  Bottom 0.203: DDS1.4 39.36,22.85 36.82,20.31 36.82,12.05 v35.55,10.79 | PAR.4 41.9,6.02 39.36,6.02 38.09,7.29 v38.09,7.93 37.45,7.93 36.82,8.56 25.39,8.56 24.12,9.83 v24.12,12.37
PB3  (via drill 0.51)
  Top 0.203: v66.35,9.52 64.76,7.93 64.76,3.17 64.44,2.85 45.71,2.85 | v27.29,2.21 23.16,2.21 22.21,3.17 22.21,6.34 23.8,7.93 23.8,11.42 22.49,12.73 IC1.28 | 45.71,2.85 PAR.5 | v44.75,2.21 45.07,2.21 45.71,2.85
  Bottom 0.203: PLO3.4 61.27,22.85 62.53,21.58 62.53,13.33 v66.35,9.52 | v27.29,2.21 27.93,1.58 44.12,1.58 v44.75,2.21
PB4  (via drill 0.51)
  Top 0.203: IC1.29 34.6,13.01 36.82,10.79 45.39,10.79 v45.71,10.47 PAR.6
  Bottom 0.203: 47.61,22.85 PLO2.4 | 47.61,22.85 DDS3.4 | v45.71,10.47 47.61,12.37 47.61,22.85
PB5
  Top 0.203: IC1.30 35.23,13.64 37.45,11.42 46.34,11.42 46.98,10.79 46.98,6.66 48.25,5.39 PAR.7
  Bottom 0.203: PAR.7 48.25,4.12 50.15,2.21 71.43,2.21 73.01,3.8 73.01,18.72 71.43,20.31 DDS2.3
PB6
  Top 0.203: IC1.31 35.86,14.28 38.09,12.05 46.66,12.05 48.25,10.47 PAR.8
  Bottom 0.203: DDS2.4 72.38,22.85 73.65,21.58 73.65,3.48 71.74,1.58 49.52,1.58 46.98,4.12 46.98,6.02 PAR.8
PB7
  Top 0.203: IC1.32 36.5,14.91 38.72,12.69 46.98,12.69 49.52,10.15 49.52,6.02 PAR.9
  Bottom 0.203: DDS2.5 69.2,25.39 67.61,23.8 67.61,12.69 69.84,10.47 69.84,3.8 69.52,3.48 52.06,3.48 PAR.9
PD0  (via drill 0.51)
  Top 0.203: IC1.52 32.69,27.61 33.64,26.66 34.91,26.66 35.55,27.29 44.12,27.29 v44.44,27.61 | PAR.17 59.68,6.02 59.68,7.93 55.23,12.37 v51.74,12.37
  Bottom 0.203: v44.44,27.61 46.03,27.61 47.61,26.02 47.61,24.44 47.93,24.12 52.38,24.12 | PLO1.5 53.64,25.39 52.38,24.12 | v51.74,12.37 52.38,13.01 52.38,24.12
PD1  (via drill 0.51)
  Top 0.203: v34.28,27.61 33.64,28.25 IC1.53 | PAR.16 57.14,8.56 52.06,8.56 47.29,13.33 39.36,13.33 36.82,15.87 v35.23,15.87
  Bottom 0.203: v35.23,15.87 35.86,16.5 35.86,21.9 39.36,25.39 | 39.36,25.39 DDS1.5 | v34.28,27.61 35.55,26.34 39.04,26.34 39.36,26.02 39.36,25.39
PD2  (via drill 0.51)
  Top 0.203: IC1.54 34.28,28.88 35.23,27.93 38.72,27.93 v40.95,30.15
  Bottom 0.203: 57.77,25.39 PLO3.5 | v40.95,30.15 57.14,30.15 57.77,29.52 57.77,25.39 | PAR.14 57.77,9.2 57.77,25.39
PD3  (via drill 0.51)
  Top 0.203: v42.21,9.2 41.9,8.88 41.9,6.02 PAR.1 | v35.23,29.2 34.91,29.52 IC1.55
  Bottom 0.203: v42.21,9.2 42.53,9.52 42.53,25.39 | 42.53,25.39 DDS3.5 | v35.23,29.2 37.14,27.29 41.58,27.29 42.53,26.34 42.53,25.39
PD4  (via drill 0.51)
  Top 0.203: IC1.56 36.18,30.15 v37.45,28.88
  Bottom 0.203: v37.45,28.88 46.03,28.88 49.52,25.39 PLO2.5
PD5
  Top 0.203: IC1.1 24.44,30.15 26.98,27.61 26.98,6.02 SV2.2
PD6
  Top 0.203: IC1.2 21.58,29.52 21.26,29.83 21.26,35.55 22.85,37.14 31.42,37.14 PD.3
PD7
  Top 0.203: IC1.3 24.75,28.88 26.34,27.29 26.34,7.93 SV2.1
RESET
  Top 0.203: IC1.49 29.83,25.71 27.93,27.61 27.93,29.3 24.22,33.01 C14.1 R9.1
SCL
  Top 0.203: IC1.22 20.94,16.82 19.04,14.91 19.04,14.6 | 19.04,14.6 I2C.1 19.04,8.56 14.91,4.44 IC3.6 | 19.04,14.6 R3.1
SDA  (via drill 0.51)
  Top 0.203: IC1.23 21.26,16.18 19.99,14.91 v19.99,12.05 | IC3.5 14.91,5.71 16.5,7.29 I2C.2 16.5,12.05 | 16.5,12.05 16.5,12.27 R4.1 | 16.5,12.05 v18.09,12.05
  Bottom 0.203: v18.09,12.05 v19.99,12.05

### Text on the board
_tsilk: 10u | 10u | 78L10 | 10u/35v | L1 | D1 | IN | COM | OUT | 1u | 10 | D2 | TC7662B | L3 | 1u | 1u | 10u | D1 | D4 | 10 | 10 | 10u/35v | 7805 | 1u | 150 | TPS3820 | 1u | 1u | 27k | 1u | 1u | C16 | 1u | C15 | 1u | C2 | R2 | R1 | C1 | 1u | R3 | 1u | 1u | 1u | 1u | 1u | 1u | R4 | CY7C68013A-56PVXC | 1u | PAR | 26 | 1 | 24C64-I/SN
_bsilk: +12v | USB-CB Rev 0 | +10v | For use with Scotty's Spectrum Analyzer | http://www.scottyspectrumanalyzer.com/ | +10v | +10v | +12-15v | GND | PD | GND | PWR ON | Q1 | 6 | 6 | 6 | 6 | 5 | 5 | 5 | USB | DDS1 | DDS3 | PLO2 | PLO1 | PLO3 | ADC | DDS2 | 1 | 1 | 1 | 1 | 1 | 1 | 1 | GND | +5V | SDA | SCL | I2C | http://www.tapr.org/OHL | Licensed under the TAPR Open Hardware License | Copyright William Dillon, July 2011 | PB0 | PB2 | PB4 | PB6 | PA4 | PA3 | PD2 | PD1 | PD7 | PD5 | PA3 | PA2 | PA1 | PA0 | PD3 | PB1 | PB3 | PB5 | PB7 | PA5 | PA2 | PD0